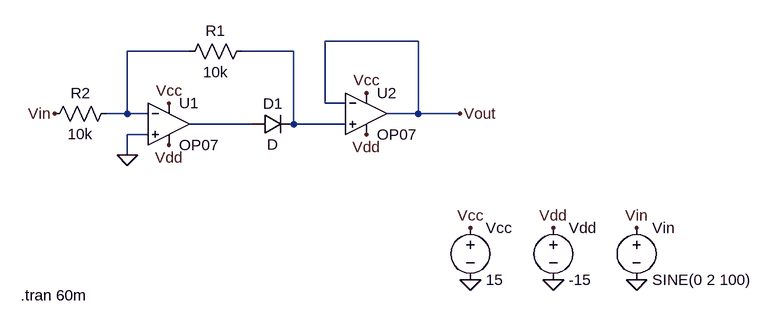
[diagram p0: schematic Diode3.asc]
Diode3.asc, the LTspice schematic file:
Version 4
SHEET 1 992 680
WIRE 464 64 320 64
WIRE 112 80 16 80
WIRE 272 80 192 80
WIRE 320 160 320 64
WIRE 352 160 320 160
WIRE 16 176 16 80
WIRE 16 176 -16 176
WIRE 48 176 16 176
WIRE 464 176 464 64
WIRE 464 176 416 176
WIRE 528 176 464 176
WIRE 208 192 112 192
WIRE 272 192 272 80
WIRE 352 192 272 192
WIRE 48 208 16 208
WIRE 16 240 16 208
FLAG 16 240 0
FLAG 544 432 0
FLAG 672 432 0
FLAG 800 432 0
FLAG 544 352 Vcc
FLAG 80 160 Vcc
FLAG 384 144 Vcc
FLAG 80 224 Vdd
FLAG 384 208 Vdd
FLAG 672 352 Vdd
FLAG 800 352 Vin
FLAG -96 176 Vin
FLAG 528 176 Vout
SYMBOL res 208 64 R90
WINDOW 0 0 56 VBottom 2
WINDOW 3 32 56 VTop 2
SYMATTR InstName R1
SYMATTR Value 10k
SYMBOL res 0 160 R90
WINDOW 0 0 56 VBottom 2
WINDOW 3 32 56 VTop 2
SYMATTR InstName R2
SYMATTR Value 10k
SYMBOL diode 208 208 R270
WINDOW 0 32 32 VTop 2
WINDOW 3 0 32 VBottom 2
SYMATTR InstName D1
SYMBOL Opamps\\OP07 80 128 R0
SYMATTR InstName U1
SYMBOL Opamps\\OP07 384 112 R0
SYMATTR InstName U2
SYMBOL voltage 544 336 R0
WINDOW 123 0 0 Left 0
WINDOW 39 0 0 Left 0
SYMATTR InstName Vcc
SYMATTR Value 15
SYMBOL voltage 800 336 R0
WINDOW 123 0 0 Left 0
WINDOW 39 0 0 Left 0
SYMATTR InstName Vin
SYMATTR Value SINE(0 2 100)
SYMBOL voltage 672 336 R0
WINDOW 123 0 0 Left 0
WINDOW 39 0 0 Left 0
SYMATTR InstName Vdd
SYMATTR Value -15
TEXT -148 456 Left 2 !.tran 60m

The netlist it stands for:
* Diode3.asc
R1 N002 N001 10k
R2 N001 Vin 10k
D1 N003 N002 D
XU1 0 N001 Vcc Vdd N003 LT1001  ; OP07, pins In+ In- V+ V- OUT
XU2 N002 Vout Vcc Vdd Vout LT1001  ; OP07, pins In+ In- V+ V- OUT
Vcc Vcc 0 15
Vin Vin 0 SINE(0 2 100)
Vdd Vdd 0 -15
.model D D
.lib standard.dio
.tran 60m
.lib LTC.lib
.backanno
.end

* Results of the author's LTspice run, read from the files saved beside the schematic
* Operating Point, zero values left out:
*   V(vcc) = 15 V
*   V(vdd) = -15 V
*   I(Vdd) = 4.5 mA
*   I(Vcc) = -4.5 mA
*   Ix(u1:3) = 2.25 mA
*   Ix(u1:4) = -2.25 mA
*   Ix(u2:3) = 2.25 mA
*   Ix(u2:4) = -2.25 mA
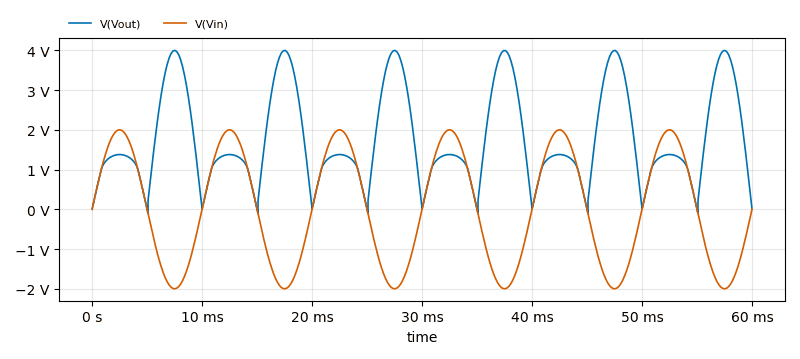
[diagram p1: Transient Analysis of Diode3.asc, plotted from the saved traces]
* Transient Analysis, 1 run:
*   V(Vout): min -108.1 mV, max 3.999 V, average 1.781 V, rms 2.145 V, last 4.743 mV
*   V(Vin): min -2 V, max 2 V, average 302.8 µV, rms 1.414 V, last 0 V